# Altium schematic sheet 多功能遥控门铃的设计_2023-04-10.schdoc
size 314 x 222 mm
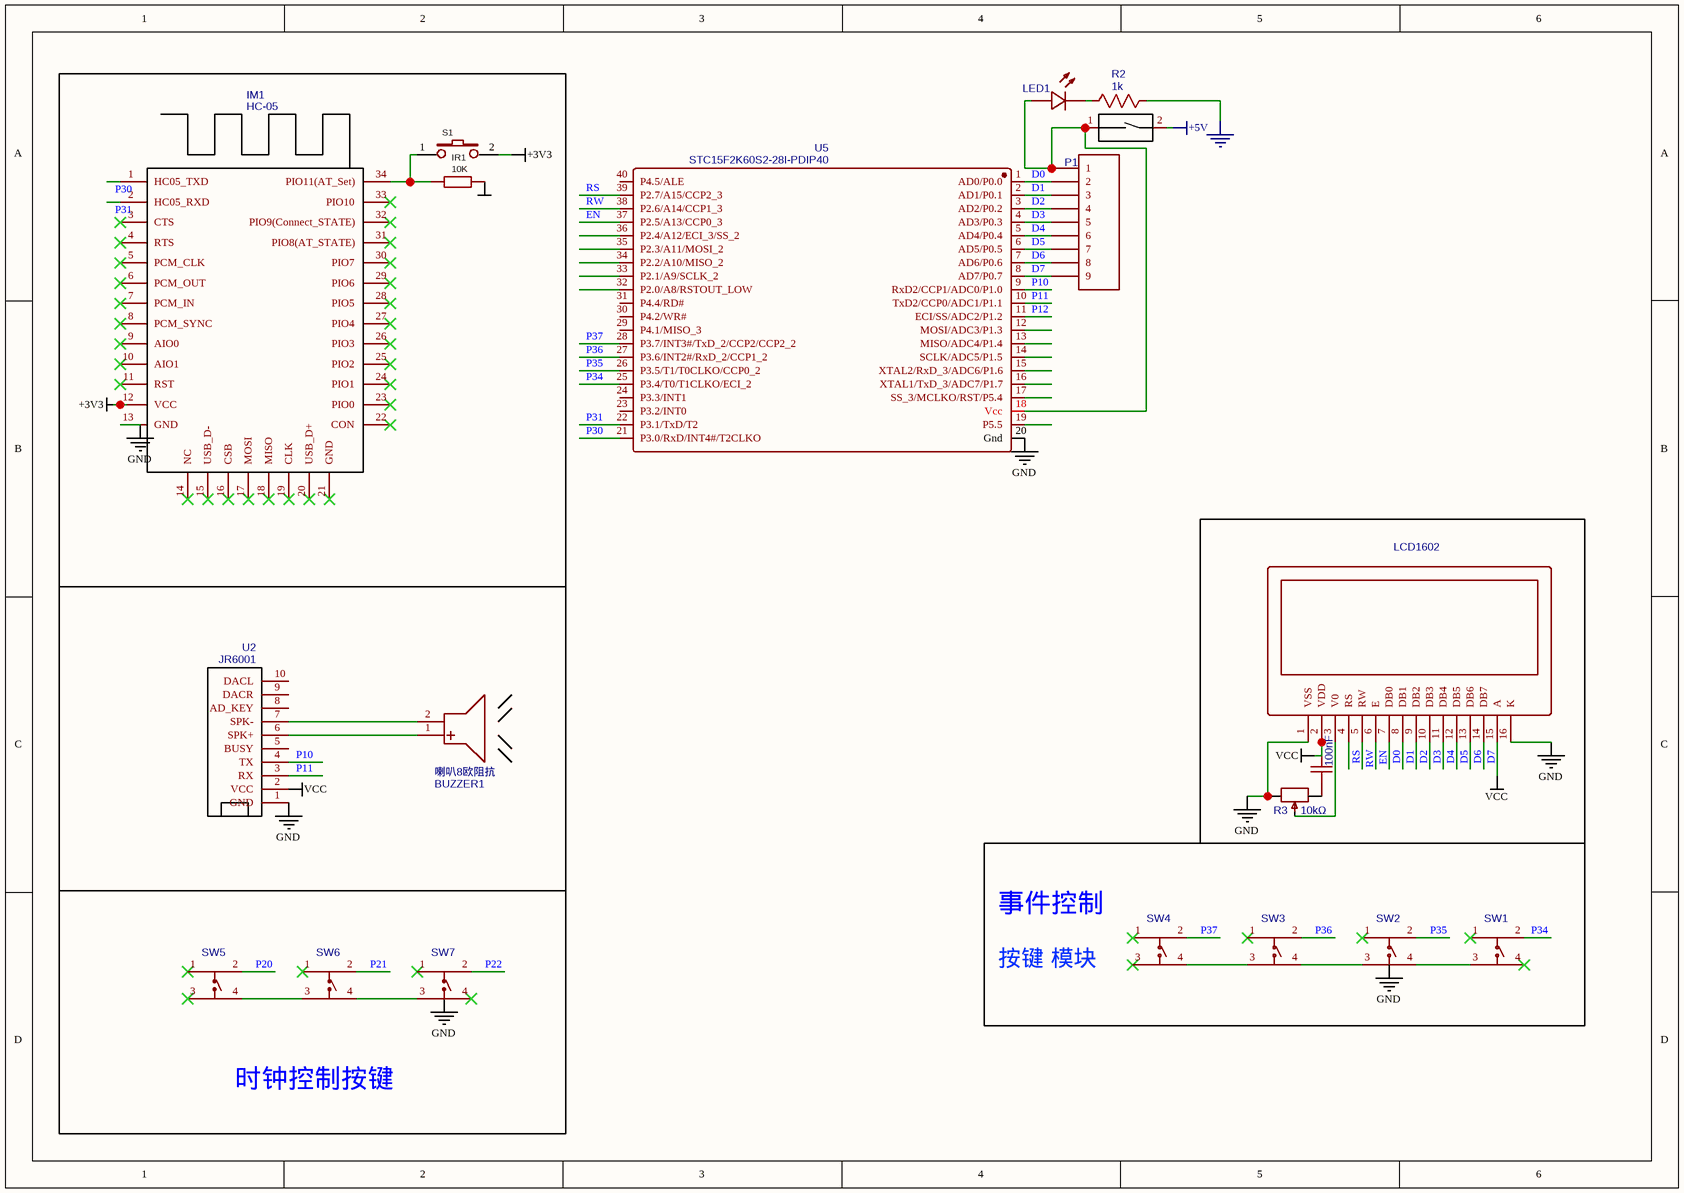
[diagram p0: 多功能遥控门铃的设计_2023-04-10.schdoc]

## Parts
BUZZER1  喇叭8欧阻抗  [GMD0955YB-9MM]
C1  100nF  [C0402]
DIP1  VDG/S-01L blue  [VDG/S-01L]  (value not drawn)
IKEY1  S1  [KEY-3*3*1.5]
IM1  HC-05  [HC-05]
IR1  10K  [R_0603]
LCD1602  1  [MODULE-TH_LCM1602K]  (value not drawn)
LED1  LED-3MM  [LED-3MM/2.54]  (value not drawn)
P1  SIP9  [HDR1X9]  (value not drawn)
R2  1k  [AXIAL-0.3]
R3  10kΩ  [RES-ADJ-TH_3296W]
SW1  KH-6X6X6H-STM  [SW-SMD_4P-L6.0-W6.0-P4.50-LS9.2]  (value not drawn)
SW2  KH-6X6X6H-STM  [SW-SMD_4P-L6.0-W6.0-P4.50-LS9.2]  (value not drawn)
SW3  KH-6X6X6H-STM  [SW-SMD_4P-L6.0-W6.0-P4.50-LS9.2]  (value not drawn)
SW4  KH-6X6X6H-STM  [SW-SMD_4P-L6.0-W6.0-P4.50-LS9.2]  (value not drawn)
SW5  KH-6X6X6H-STM  [SW-SMD_4P-L6.0-W6.0-P4.50-LS9.2]  (value not drawn)
SW6  KH-6X6X6H-STM  [SW-SMD_4P-L6.0-W6.0-P4.50-LS9.2]  (value not drawn)
SW7  KH-6X6X6H-STM  [SW-SMD_4P-L6.0-W6.0-P4.50-LS9.2]  (value not drawn)
U2  JR6001  [JR6001]
U5  STC15F2K60S2-28I-PDIP40  [DIP-40_L52.3-W13.9-P2.54-LS15.2-BL]

## Blocks framed on the sheet
时钟控制按键: SW5-SW7
事件控制: SW1-SW4

## Nets
+3V3: IKEY1.2 IM1.12(VCC)
+5V: DIP1.2
GND: IM1.13(GND) IR1.2 LCD1602.1(VSS) LCD1602.16(K) R2.1 R3.1 U2.1(GND) U5.20(Gnd)
VCC: C1.2 LCD1602.2(VDD) LCD1602.15(A) U2.2(VCC)
D0: LCD1602.7(DB0) P1.2 U5.1(AD0/P0.0)
D1: LCD1602.8(DB1) P1.3 U5.2(AD1/P0.1)
D2: LCD1602.9(DB2) P1.4 U5.3(AD2/P0.2)
D3: LCD1602.10(DB3) P1.5 U5.4(AD3/P0.3)
D4: LCD1602.11(DB4) P1.6 U5.5(AD4/P0.4)
D5: LCD1602.12(DB5) P1.7 U5.6(AD5/P0.5)
D6: LCD1602.13(DB6) P1.8 U5.7(AD6/P0.6)
D7: LCD1602.14(DB7) P1.9 U5.8(AD7/P0.7)
EN: LCD1602.6(E) U5.37(P2.5/A13/CCP0_3)
P10: U2.4(TX) U5.9(RxD2/CCP1/ADC0/P1.0)
P11: U2.3(RX) U5.10(TxD2/CCP0/ADC1/P1.1)
P12: U5.11(ECI/SS/ADC2/P1.2)
P20: SW5.2(B)
P21: SW6.2(B)
P22: SW7.2(B)
P30: U5.21(P3.0/RxD/INT4#/T2CLKO)
P31: U5.22(P3.1/TxD/T2)
P34: SW1.2(B) U5.25(P3.4/T0/T1CLKO/ECI_2)
P35: SW2.2(B) U5.26(P3.5/T1/T0CLKO/CCP0_2)
P36: SW3.2(B) U5.27(P3.6/INT2#/RxD_2/CCP1_2)
P37: SW4.2(B) U5.28(P3.7/INT3#/TxD_2/CCP2/CCP2_2)
RS: LCD1602.4(RS) U5.39(P2.7/A15/CCP2_3)
RW: LCD1602.5(RW) U5.38(P2.6/A14/CCP1_3)
NetBUZZER1_1: BUZZER1.1(+) U2.6(SPK+)
NetBUZZER1_2: BUZZER1.2(-) U2.7(SPK-)
NetC1_1: C1.1 R3.3
NetDIP1_1: DIP1.1 LED1.1(+) P1.1 U5.18(Vcc)
NetIKEY1_1: IKEY1.1 IM1.34(PIO11(AT_Set)) IR1.1
NetLCD1602_3: LCD1602.3(V0) R3.2
NetLED1_2: LED1.2(-) R2.2
NetSW1_3: SW1.3(C) SW2.4(D)
NetSW2_3: SW2.3(C) SW3.4(D)
NetSW3_3: SW3.3(C) SW4.4(D)
NetSW5_4: SW5.4(D) SW6.3(C)
NetSW6_4: SW6.4(D) SW7.3(C)

Not connected (* = marked no-connect by the designer): IM1 1(HC05_TXD) 2(HC05_RXD) 3(CTS)* 4(RTS)* 5(PCM_CLK)* 6(PCM_OUT)* 7(PCM_IN)* 8(PCM_SYNC)* 9(AIO0)* 10(AIO1)* 11(RST)* 14(NC)* 15(USB_D-)* 16(CSB)* 17(MOSI)* 18(MISO)* 19(CLK)* 20(USB_D+)* 21(GND)* 22(CON)* 23(PIO0)* 24(PIO1)* 25(PIO2)* 26(PIO3)* 27(PIO4)* 28(PIO5)* 29(PIO6)* 30(PIO7)* 31(PIO8(AT_STATE))* 32(PIO9(Connect_STATE))* 33(PIO10)*; SW1 1(A)* 4(D)*; SW2 1(A)*; SW3 1(A)*; SW4 1(A)* 3(C)*; SW5 1(A)* 3(C)*; SW6 1(A)*; SW7 1(A)* 4(D)*; U2 5(BUSY) 8(AD_KEY) 9(DACR) 10(DACL); U5 12(MOSI/ADC3/P1.3) 13(MISO/ADC4/P1.4) 14(SCLK/ADC5/P1.5) 15(XTAL2/RxD_3/ADC6/P1.6) 16(XTAL1/TxD_3/ADC7/P1.7) 17(SS_3/MCLKO/RST/P5.4) 19(P5.5) 23(P3.2/INT0) 24(P3.3/INT1) 29(P4.1/MISO_3) 30(P4.2/WR#) 31(P4.4/RD#) 32(P2.0/A8/RSTOUT_LOW) 33(P2.1/A9/SCLK_2) 34(P2.2/A10/MISO_2) 35(P2.3/A11/MOSI_2) 36(P2.4/A12/ECI_3/SS_2) 40(P4.5/ALE)

## Notes on the sheet
- 按键 模块
- Labels drawn without touching a wire or pin: GND, P30, P31

## Library data of the parts
BUZZER1 = 喇叭8欧阻抗: BOM_Manufacturer: INGHAi; BOM_Manufacturer Part: GMD0955YB-12V2700; Contributor: kennen; BOM_Supplier: LCSC; BOM_Supplier Part: C265130; spicePre: B; spiceSymbolName: 喇叭8欧阻抗
C1 = 100nF: BOM_Manufacturer: YAGEO(国巨); BOM_Manufacturer Part: CC0402MRY5V8BB104; nameAlias: Capacitance; Contributor: LCSC; BOM_Supplier: LCSC; BOM_Supplier Part: C327271; BOM_JLCPCB Part Class: Extended Part; spicePre: C; spiceSymbolName: CC0402MRY5V8BB104
DIP1 = VDG/S-01L blue: BOM_Manufacturer: ReliaPro; BOM_Supplier Part: C47086; BOM_Supplier: LCSC; BOM_Manufacturer Part: VDG/S-01L blue; image: //image.lceda.cn/szlcsc/C47086.jpg; spicePre: D
IKEY1 = S1: BOM_Manufacturer: ReliaPro; BOM_Manufacturer Part: 直插轻触开关 6*6*9.5; Contributor: Zhang9999999; BOM_Supplier: LCSC; spicePre: K
IM1 = HC-05: sourceId: LXR9rJ0Uc; Contributor: luohaiyang; timeStamp: 1459465771; spicePre: M; spiceSymbolName: HC-05
IR1 = 10K: nameAlias: Value(Ω); BOM_Manufacturer Part: ?; spicePre: R; spiceSymbolName: Resistor
LCD1602 = 1: BOM_Manufacturer: LONTECH(厦门龙特); BOM_Manufacturer Part: LCM1602K-NSW-BBW-33V33; BOM_Supplier: LCSC; BOM_Supplier Part: C83272; BOM_JLCPCB Part Class: Extended Part; spicePre: L; spiceSymbolName: LCM1602K-NSW-BBW-33V33
LED1 = LED-3MM: BOM_Manufacturer: EVERLIGHT; BOM_Manufacturer Part: 204-10SURD/S530-A3; BOM_Supplier Part: C99772; BOM_Supplier: LCSC; spicePre: L
P1 = SIP9: catid: 20; BOM_Manufacturer Part: ?; spicePre: P
R2 = 1k: nameAlias: Value(Ω); BOM_Manufacturer Part: ?; spicePre: R; spiceSymbolName: Res_AXIAL-0.3(1/8W)_US
R3 = 10kΩ: BOM_Manufacturer: BOURNS; BOM_Manufacturer Part: 3296W-1-103LF; nameAlias: Resistance; Resistance(Ohms): 10K; BOM_Supplier: LCSC; BOM_Supplier Part: C34846; Resistance (Ohms): 10K; BOM_JLCPCB Part Class: Extended Part; spicePre: R; spiceSymbolName: 3296W-1-103LF
SW1-SW7 = KH-6X6X6H-STM: BOM_Manufacturer: kinghelm(金航标); Contributor: LCSC; BOM_Supplier: LCSC; BOM_Supplier Part: C2837532; BOM_Manufacturer Part: KH-6X6X6H-STM; BOM_JLCPCB Part Class: Extended Part; spicePre: S; spiceSymbolName: KH-6X6X6H-STM
U2 = JR6001: Contributor: 212308jiangyuhao; spicePre: U; spiceSymbolName: JR6001
U5 = STC15F2K60S2-28I-PDIP40: BOM_Manufacturer: STC(宏晶); BOM_Supplier: LCSC; BOM_Manufacturer Part: STC15F2K60S2-28I-PDIP40; BOM_Supplier Part: C57308; BOM_JLCPCB Part Class: Extended Part; spicePre: U; spiceSymbolName: STC15F2K60S2-28I-PDIP40